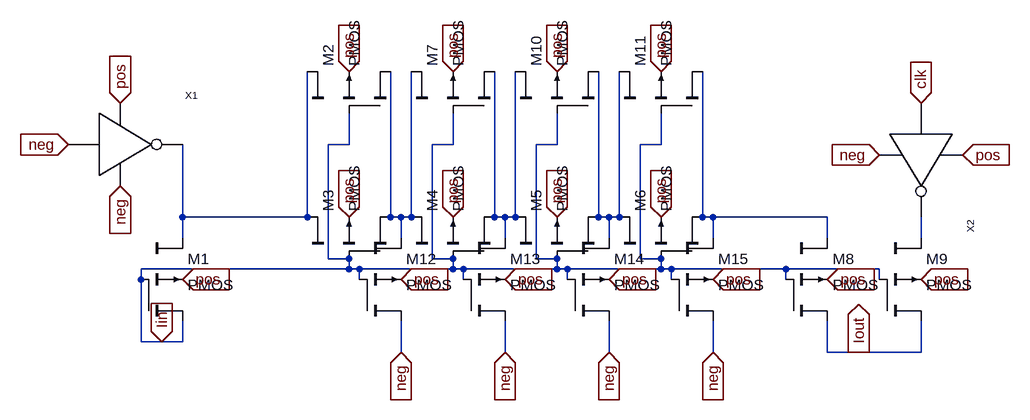
[diagram p0: schematic CurrentLvs.asc]
CurrentLvs.asc, the LTspice schematic file:
Version 4
SHEET 1 1160 680
WIRE -1520 -464 -1520 -512
WIRE -1520 -464 -1552 -464
WIRE -1360 -464 -1360 -512
WIRE -1360 -464 -1392 -464
WIRE -1200 -464 -1200 -512
WIRE -1200 -464 -1232 -464
WIRE -1040 -464 -1040 -512
WIRE -1040 -464 -1072 -464
WIRE -1776 -352 -1776 -464
WIRE -1584 -352 -1584 -576
WIRE -1584 -352 -1776 -352
WIRE -1456 -352 -1456 -576
WIRE -1440 -352 -1456 -352
WIRE -1424 -352 -1424 -576
WIRE -1424 -352 -1440 -352
WIRE -1296 -352 -1296 -576
WIRE -1280 -352 -1296 -352
WIRE -1264 -352 -1264 -576
WIRE -1264 -352 -1280 -352
WIRE -1136 -352 -1136 -576
WIRE -1120 -352 -1136 -352
WIRE -1104 -352 -1104 -576
WIRE -1104 -352 -1120 -352
WIRE -976 -352 -976 -576
WIRE -960 -352 -976 -352
WIRE -784 -352 -960 -352
WIRE -1776 -320 -1776 -352
WIRE -1440 -320 -1440 -352
WIRE -1280 -320 -1280 -352
WIRE -1120 -320 -1120 -352
WIRE -960 -320 -960 -352
WIRE -784 -320 -784 -352
WIRE -640 -320 -640 -352
WIRE -1552 -288 -1552 -464
WIRE -1520 -288 -1552 -288
WIRE -1392 -288 -1392 -464
WIRE -1360 -288 -1392 -288
WIRE -1232 -288 -1232 -464
WIRE -1200 -288 -1232 -288
WIRE -1072 -288 -1072 -464
WIRE -1040 -288 -1072 -288
WIRE -1520 -272 -1520 -288
WIRE -1520 -272 -1840 -272
WIRE -1504 -272 -1520 -272
WIRE -1360 -272 -1360 -288
WIRE -1360 -272 -1504 -272
WIRE -1344 -272 -1360 -272
WIRE -1200 -272 -1200 -288
WIRE -1200 -272 -1344 -272
WIRE -1184 -272 -1200 -272
WIRE -1040 -272 -1040 -288
WIRE -1040 -272 -1184 -272
WIRE -1024 -272 -1040 -272
WIRE -848 -272 -1024 -272
WIRE -704 -272 -848 -272
WIRE -1840 -256 -1840 -272
WIRE -1504 -256 -1504 -272
WIRE -1344 -256 -1344 -272
WIRE -1184 -256 -1184 -272
WIRE -1024 -256 -1024 -272
WIRE -848 -256 -848 -272
WIRE -704 -256 -704 -272
WIRE -1840 -160 -1840 -256
WIRE -1808 -160 -1840 -160
WIRE -1776 -160 -1776 -192
WIRE -1776 -160 -1808 -160
WIRE -1440 -144 -1440 -192
WIRE -1280 -144 -1280 -192
WIRE -1120 -144 -1120 -192
WIRE -960 -144 -960 -192
WIRE -784 -144 -784 -192
WIRE -736 -144 -784 -144
WIRE -640 -144 -640 -192
WIRE -640 -144 -736 -144
FLAG -1520 -352 pos
IOPIN -1520 -352 In
FLAG -1360 -352 pos
IOPIN -1360 -352 In
FLAG -1440 -256 pos
IOPIN -1440 -256 In
FLAG -1280 -256 pos
IOPIN -1280 -256 In
FLAG -1120 -256 pos
IOPIN -1120 -256 In
FLAG -960 -256 pos
IOPIN -960 -256 In
FLAG -784 -256 pos
IOPIN -784 -256 In
FLAG -1776 -256 pos
IOPIN -1776 -256 In
FLAG -640 -256 pos
IOPIN -640 -256 In
FLAG -1200 -352 pos
IOPIN -1200 -352 In
FLAG -1040 -352 pos
IOPIN -1040 -352 In
FLAG -1952 -464 neg
IOPIN -1952 -464 In
FLAG -1872 -400 neg
IOPIN -1872 -400 In
FLAG -1440 -144 neg
IOPIN -1440 -144 In
FLAG -1280 -144 neg
IOPIN -1280 -144 In
FLAG -1120 -144 neg
IOPIN -1120 -144 In
FLAG -960 -144 neg
IOPIN -960 -144 In
FLAG -1872 -528 pos
IOPIN -1872 -528 In
FLAG -640 -528 clk
IOPIN -640 -528 In
FLAG -704 -448 neg
IOPIN -704 -448 In
FLAG -576 -448 pos
IOPIN -576 -448 In
FLAG -1520 -576 pos
IOPIN -1520 -576 In
FLAG -1360 -576 pos
IOPIN -1360 -576 In
FLAG -1200 -576 pos
IOPIN -1200 -576 In
FLAG -1040 -576 pos
IOPIN -1040 -576 In
FLAG -1808 -160 Iin
IOPIN -1808 -160 In
FLAG -736 -144 Iout
IOPIN -736 -144 Out
SYMBOL cktsym\\pmos4 -1776 -256 R0
SYMATTR InstName M1
SYMATTR Value2 l=1.8u w=1.8u
SYMBOL cktsym\\pmos4 -1520 -352 R270
SYMATTR InstName M3
SYMATTR Value2 l=1.8u w=1.8u
SYMBOL cktsym\\pmos4 -1360 -352 R270
SYMATTR InstName M4
SYMATTR Value2 l=1.8u w=1.8u
SYMBOL cktsym\\pmos4 -1200 -352 R270
SYMATTR InstName M5
SYMATTR Value2 l=1.8u w=1.8u
SYMBOL cktsym\\pmos4 -1040 -352 R270
SYMATTR InstName M6
SYMATTR Value2 l=1.8u w=1.8u
SYMBOL cktsym\\pmos4 -784 -256 R0
SYMATTR InstName M8
SYMATTR Value2 l=1.8u w=1.8u
SYMBOL cktsym\\pmos4 -640 -256 R0
SYMATTR InstName M9
SYMATTR Value2 l=1.8u w=1.8u
SYMBOL cktsym\\pmos4 -1440 -256 R0
SYMATTR InstName M12
SYMBOL cktsym\\pmos4 -1280 -256 R0
SYMATTR InstName M13
SYMATTR Value2 l=1.8u w=1.8u
SYMBOL cktsym\\pmos4 -1120 -256 R0
SYMATTR InstName M14
SYMATTR Value2 l=1.8u w=1.8u
SYMBOL cktsym\\pmos4 -960 -256 R0
SYMATTR InstName M15
SYMATTR Value2 l=1.8u w=1.8u
SYMBOL inverter -1872 -464 R0
SYMATTR InstName X1
SYMBOL inverter -640 -448 R90
SYMATTR InstName X2
SYMBOL cktsym\\pmos4 -1520 -576 R270
SYMATTR InstName M2
SYMATTR Value2 l=1.8u w=1.8u
SYMBOL cktsym\\pmos4 -1360 -576 R270
SYMATTR InstName M7
SYMATTR Value2 l=1.8u w=1.8u
SYMBOL cktsym\\pmos4 -1200 -576 R270
SYMATTR InstName M10
SYMATTR Value2 l=1.8u w=1.8u
SYMBOL cktsym\\pmos4 -1040 -576 R270
SYMATTR InstName M11
SYMATTR Value2 l=1.8u w=1.8u

The netlist it stands for:
* CurrentLvs.asc
M1 Iin Iin N001 pos PMOS l=1.8u w=1.8u
M3 N002 Iin N001 pos PMOS l=1.8u w=1.8u
M4 N003 Iin N002 pos PMOS l=1.8u w=1.8u
M5 N004 Iin N003 pos PMOS l=1.8u w=1.8u
M6 N005 Iin N004 pos PMOS l=1.8u w=1.8u
M8 Iout Iin N005 pos PMOS l=1.8u w=1.8u
M9 Iout Iin N006 pos PMOS l=1.8u w=1.8u
M12 neg Iin N002 pos PMOS
M13 neg Iin N003 pos PMOS l=1.8u w=1.8u
M14 neg Iin N004 pos PMOS l=1.8u w=1.8u
M15 neg Iin N005 pos PMOS l=1.8u w=1.8u
XX1 neg N001 pos neg inverter  ; pins in out pos neg
XX2 clk N006 pos neg inverter  ; pins in out pos neg
M2 N002 Iin N001 pos PMOS l=1.8u w=1.8u
M7 N003 Iin N002 pos PMOS l=1.8u w=1.8u
M10 N004 Iin N003 pos PMOS l=1.8u w=1.8u
M11 N005 Iin N004 pos PMOS l=1.8u w=1.8u
.model NMOS NMOS
.model PMOS PMOS
.lib standard.mos
.backanno
.end